# EAGLE schematic et312 (EAGLE 7.3.0)

## Sheet 1 of 6
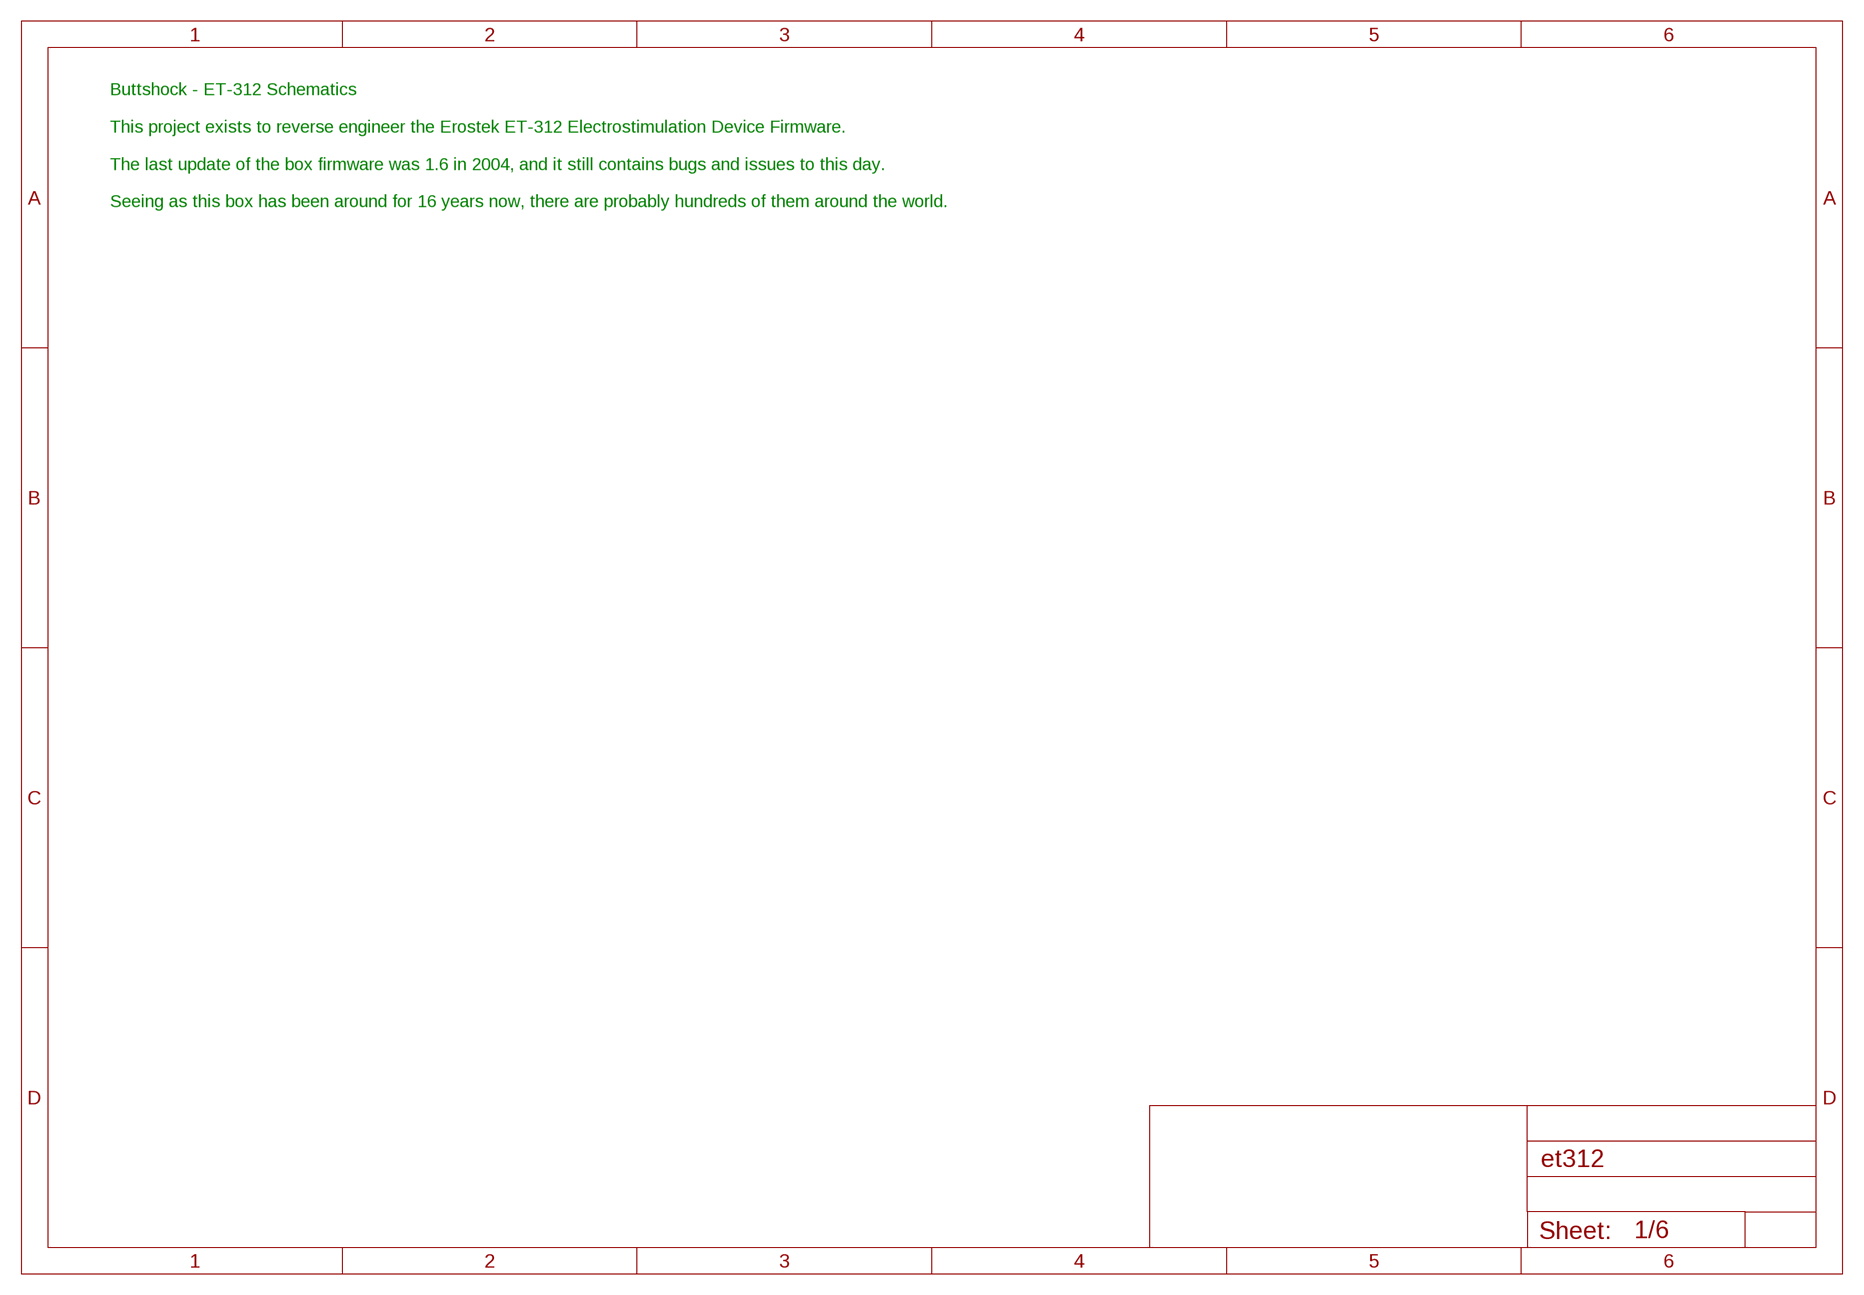
[diagram p0: schematic, sheet 1]

### Notes on the sheet
- Buttshock - ET-312 Schematics
  
  This project exists to reverse engineer the Erostek ET-312 Electrostimulation Device Firmware.
  
  The last update of the box firmware was 1.6 in 2004, and it still contains bugs and issues to this day.
  
  Seeing as this box has been around for 16 years now, there are probably hundreds of them around the world.

## Sheet 2 of 6
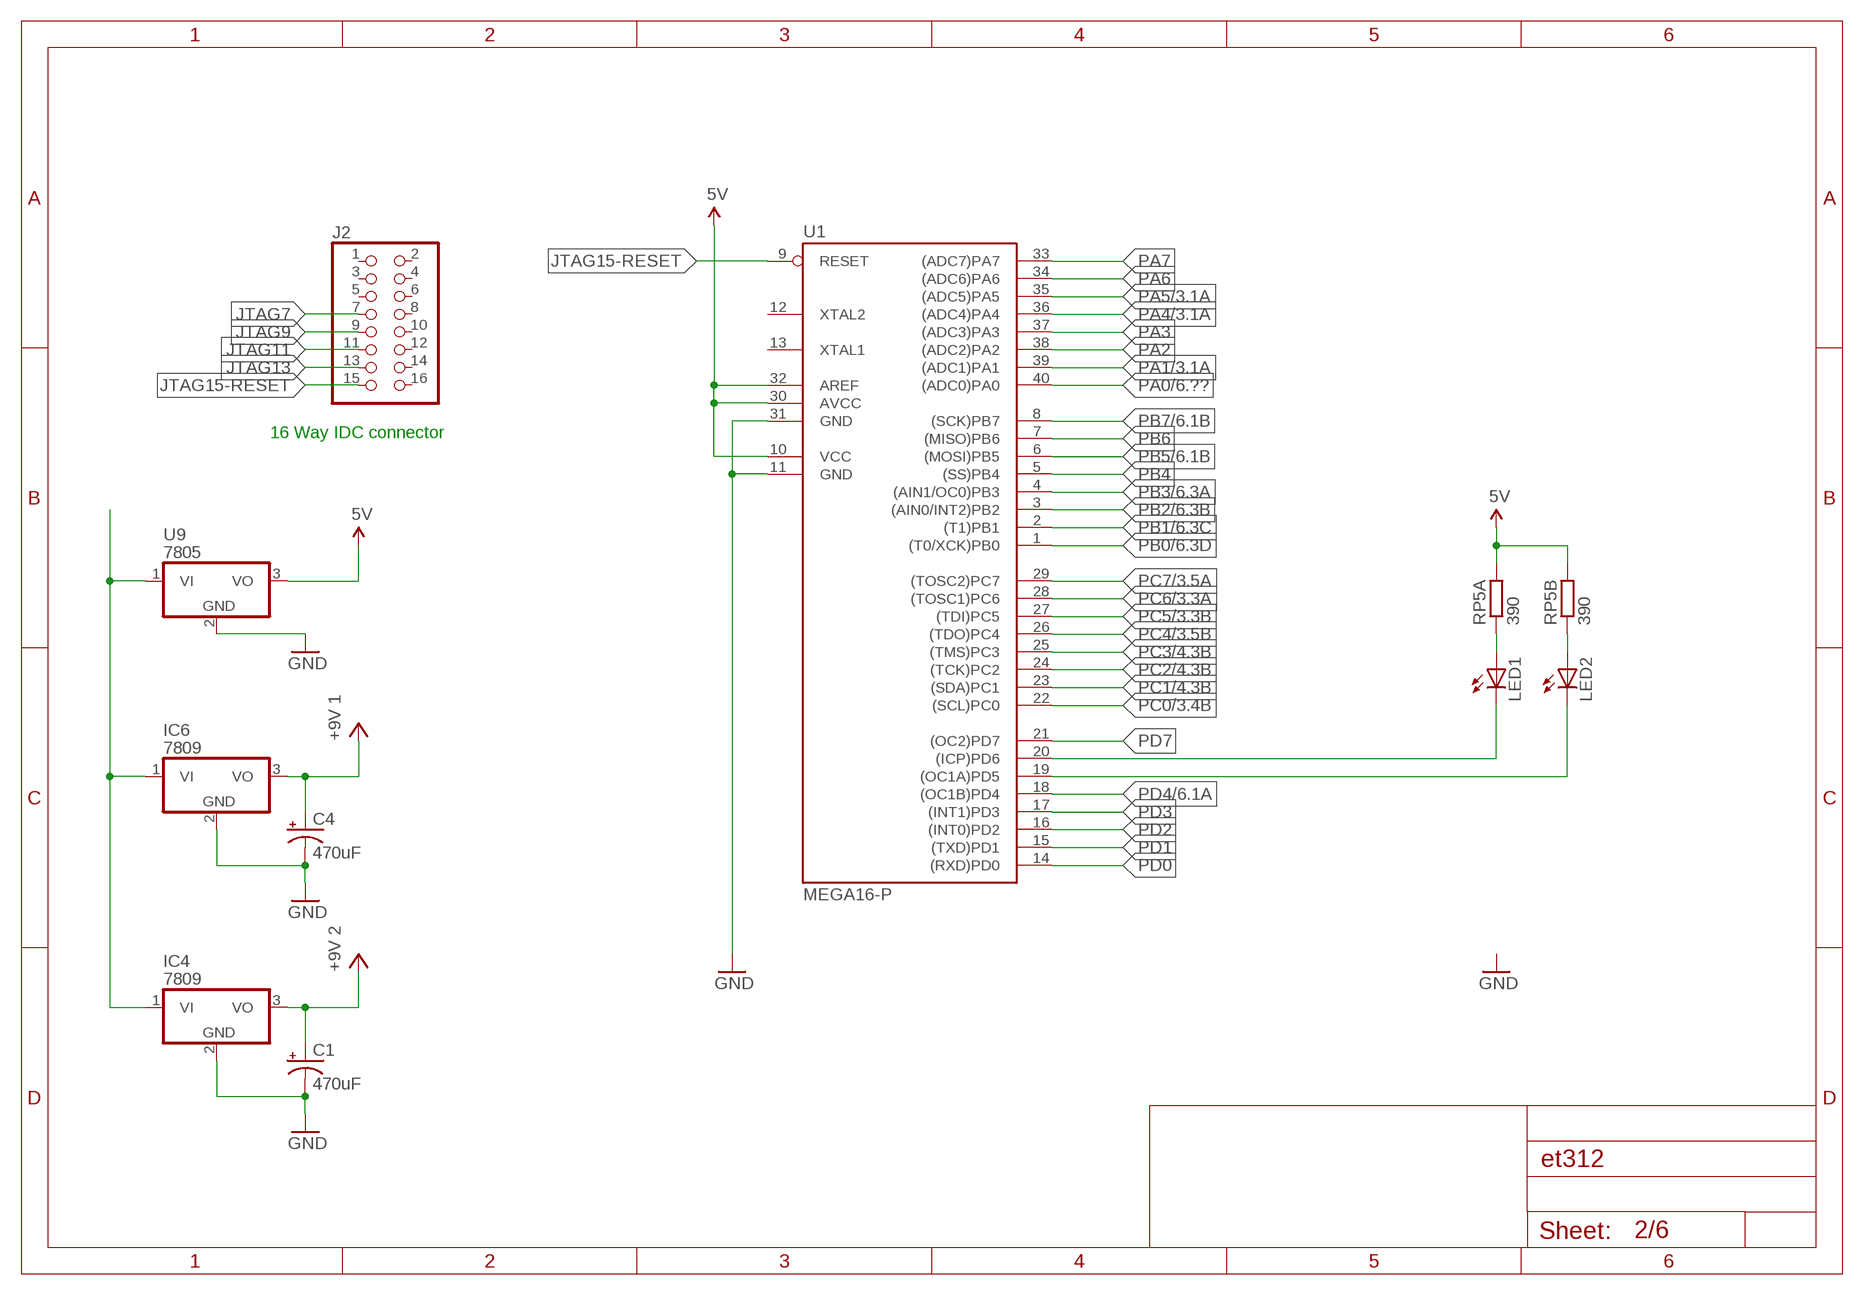
[diagram p1: schematic, sheet 2]

### Parts
C1  470uF  CAP_POLPTH1  [CPOL-RADIAL-100UF-25V]
C4  470uF  CAP_POLPTH1  [CPOL-RADIAL-100UF-25V]
IC4  7809  7805T  [TO220H]
IC6  7809  7805T  [TO220H]
J2  PINHD-2X8  [2X08]
LED1  LED3MM  [LED3MM]
LED2  LED3MM  [LED3MM]
RP5A  390  R-EU_0207/7  [0207/7]
RP5B  390  R-EU_0207/7  [0207/7]
U1  MEGA16-P  [DIL40]
U9  7805  7805T  [TO220H]

### Nets
5V: RP5A.2 RP5B.2 U1.10(VCC) U1.30(AVCC) U1.32(AREF) U9.3(VO) ; also sheet 3
GND: C1.2(-) C4.2(-) IC4.2(GND) IC6.2(GND) U1.11(GND) U1.31(GND) U9.2(GND) ; also sheet 3,6
JTAG7: J2.7
JTAG9: J2.9
JTAG11: J2.11
JTAG13: J2.13
JTAG15-RESET: J2.15 U1.9(RESET)
N$17: IC4.1(VI) IC6.1(VI) U9.1(VI)
N$23: LED2.A RP5B.1
N$29: LED1.A RP5A.1
PA0: U1.40((ADC0)PA0) ; also sheet 6
PA1: U1.39((ADC1)PA1) ; also sheet 3
PA2: U1.38((ADC2)PA2)
PA3: U1.37((ADC3)PA3)
PA4: U1.36((ADC4)PA4) ; also sheet 3
PA5: U1.35((ADC5)PA5) ; also sheet 3
PA6: U1.34((ADC6)PA6)
PA7: U1.33((ADC7)PA7)
PB0: U1.1((T0/XCK)PB0) ; also sheet 6
PB1: U1.2((T1)PB1) ; also sheet 6
PB2: U1.3((AIN0/INT2)PB2) ; also sheet 6
PB3: U1.4((AIN1/OC0)PB3) ; also sheet 6
PB4: U1.5((SS)PB4)
PB5: U1.6((MOSI)PB5) ; also sheet 6
PB6: U1.7((MISO)PB6)
PB7: U1.8((SCK)PB7) ; also sheet 6
PC0: U1.22((SCL)PC0) ; also sheet 3
PC1: U1.23((SDA)PC1) ; also sheet 4
PC2: U1.24((TCK)PC2) ; also sheet 4
PC3: U1.25((TMS)PC3) ; also sheet 4
PC4: U1.26((TDO)PC4) ; also sheet 3,4
PC5: U1.27((TDI)PC5) ; also sheet 3,4
PC6: U1.28((TOSC1)PC6) ; also sheet 3,4
PC7: U1.29((TOSC2)PC7) ; also sheet 3,4
PD0: U1.14((RXD)PD0)
PD1: U1.15((TXD)PD1)
PD2: U1.16((INT0)PD2)
PD3: U1.17((INT1)PD3)
PD4: U1.18((OC1B)PD4) ; also sheet 6
PD5: LED2.K(C) U1.19((OC1A)PD5)
PD6: LED1.K(C) U1.20((ICP)PD6)
PD7: U1.21((OC2)PD7)
VCC: C1.1(+) C4.1(+) IC4.3(VO) IC6.3(VO) ; supply symbol labelled +9V 1, +9V 2 ; also sheet 6
Unconnected: J2.1 J2.2 J2.3 J2.4 J2.5 J2.6 J2.8 J2.10 J2.12 J2.14 J2.16 U1.12(XTAL2) U1.13(XTAL1)

### Notes on the sheet
- 16 Way IDC connector

## Sheet 3 of 6
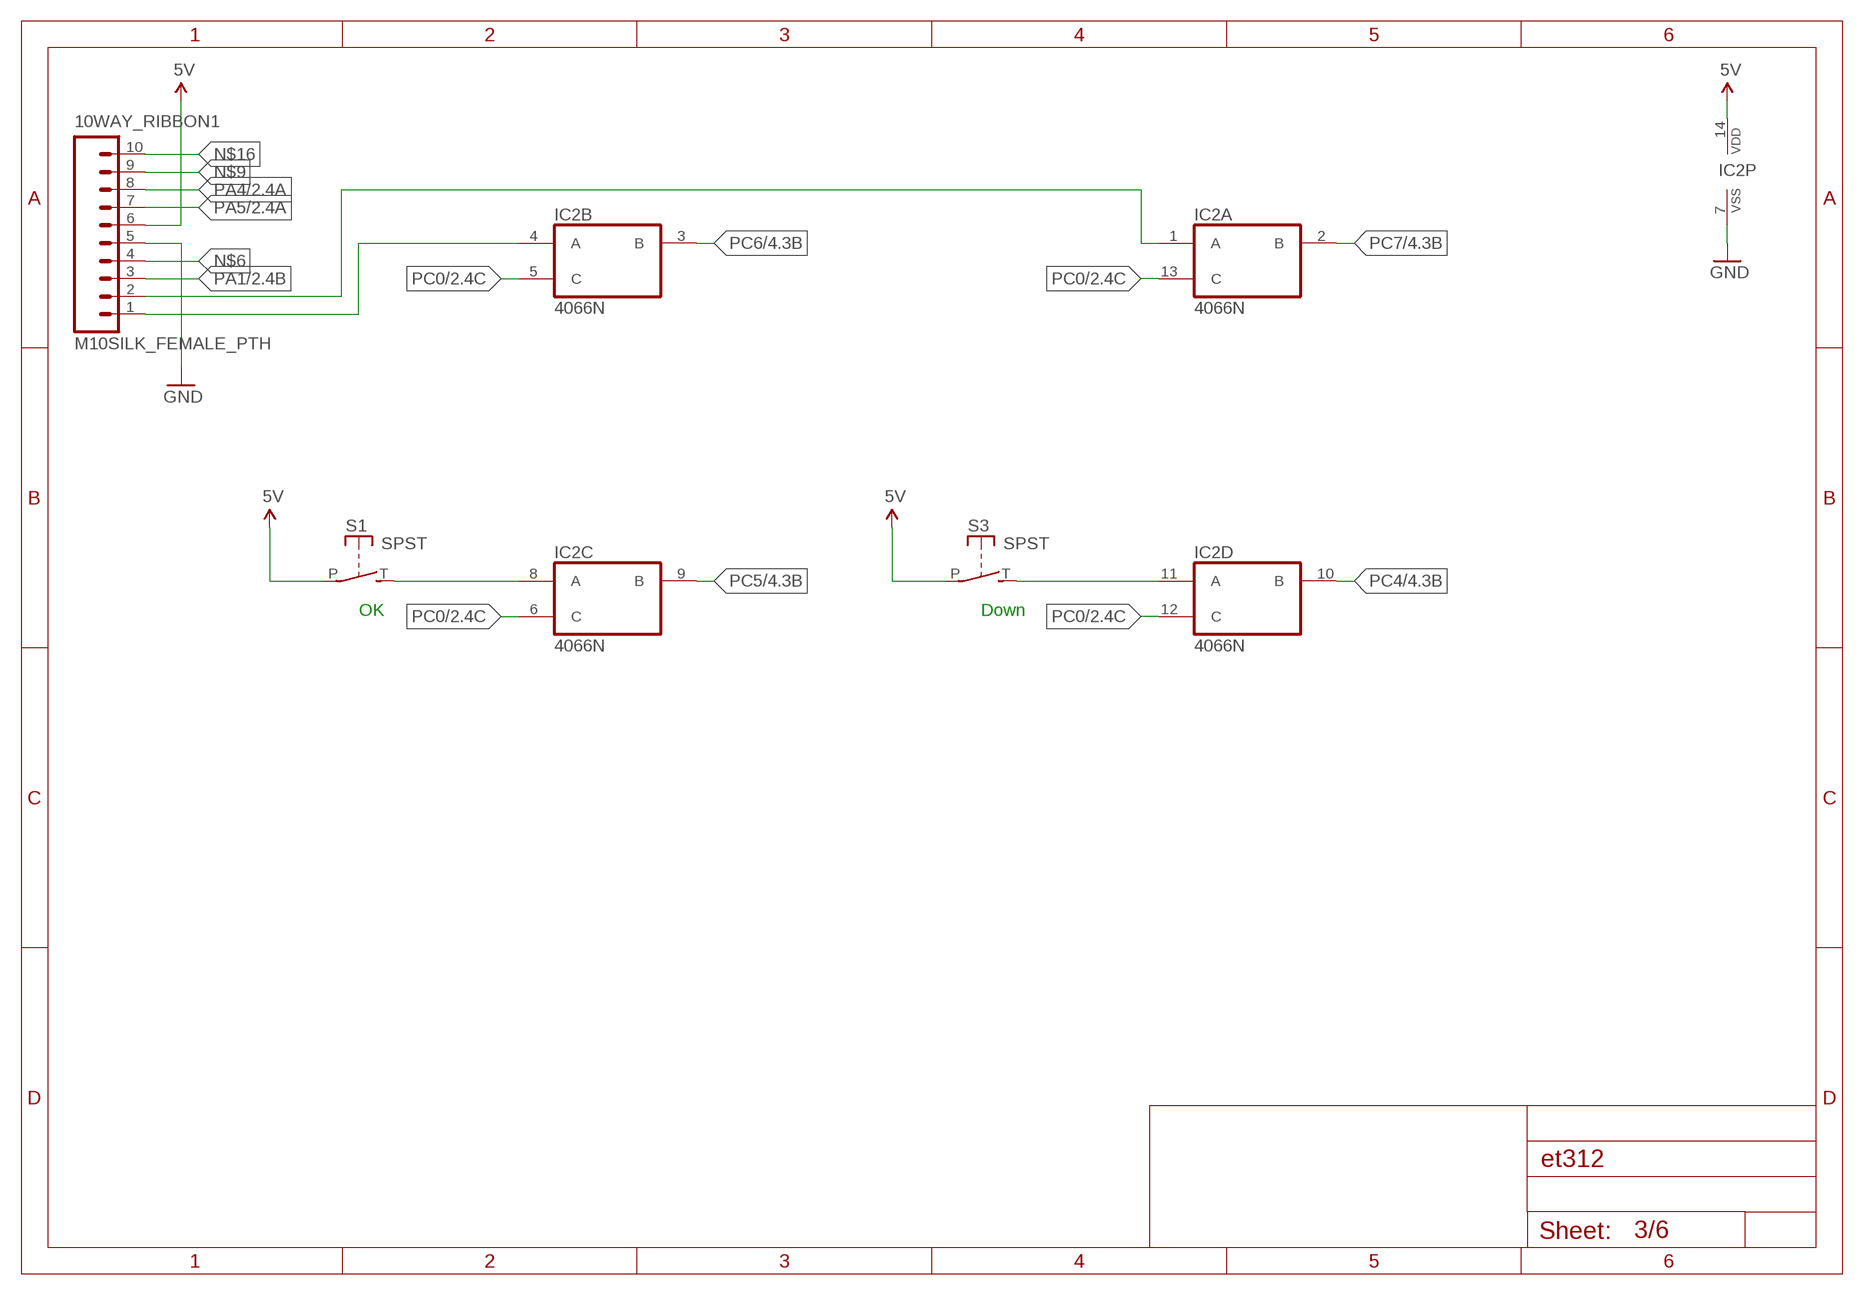
[diagram p2: schematic, sheet 3]

### Parts
10WAY_RIBBON1  M10SILK_FEMALE_PTH  [1X10]
IC2  4066N  [DIL14]
S1  SPST  [JUDCOSPST]
S3  SPST  [JUDCOSPST]

### Nets
5V: 10WAY_RIBBON1.6 IC2.14(P:VDD) S1.P S3.P ; also sheet 2
GND: 10WAY_RIBBON1.5 IC2.7(P:VSS) ; also sheet 2,6
N$4: IC2.8(C:A) S1.T(S)
N$5: IC2.11(D:A) S3.T(S)
N$6: 10WAY_RIBBON1.4
N$7: 10WAY_RIBBON1.1 IC2.4(B:A)
N$8: 10WAY_RIBBON1.2 IC2.1(A:A)
N$9: 10WAY_RIBBON1.9
N$16: 10WAY_RIBBON1.10
PA1: 10WAY_RIBBON1.3 ; also sheet 2
PA4: 10WAY_RIBBON1.8 ; also sheet 2
PA5: 10WAY_RIBBON1.7 ; also sheet 2
PC0: IC2.5(B:C) IC2.6(C:C) IC2.12(D:C) IC2.13(A:C) ; also sheet 2
PC4: IC2.10(D:B) ; also sheet 2,4
PC5: IC2.9(C:B) ; also sheet 2,4
PC6: IC2.3(B:B) ; also sheet 2,4
PC7: IC2.2(A:B) ; also sheet 2,4

### Notes on the sheet
- OK | Down

## Sheet 4 of 6
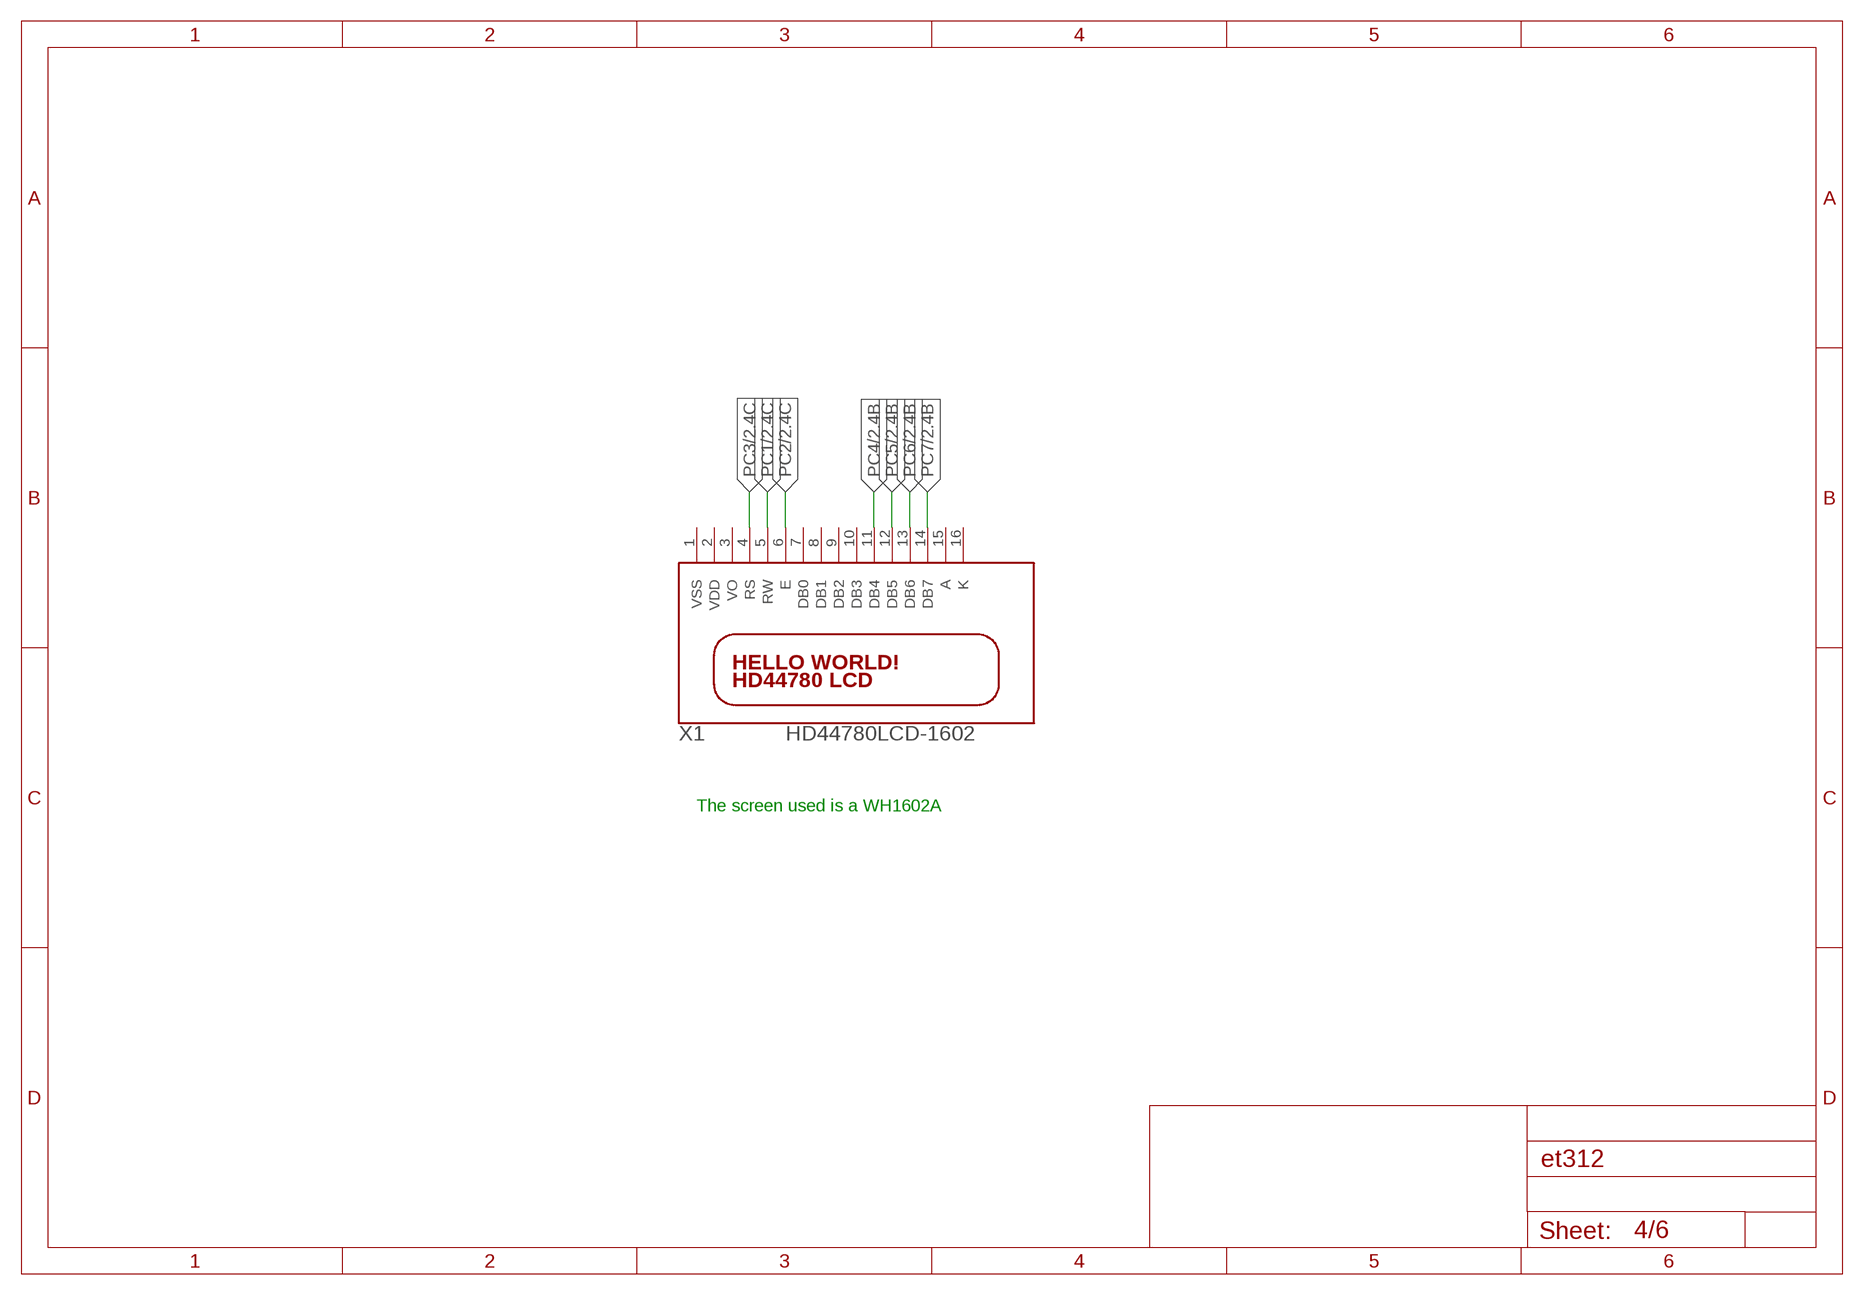
[diagram p3: schematic, sheet 4]

### Parts
X1  HD44780LCD-1602  [LCD1602]

### Nets
PC1: X1.5(RW) ; also sheet 2
PC2: X1.6(E) ; also sheet 2
PC3: X1.4(RS) ; also sheet 2
PC4: X1.11(DB4) ; also sheet 2,3
PC5: X1.12(DB5) ; also sheet 2,3
PC6: X1.13(DB6) ; also sheet 2,3
PC7: X1.14(DB7) ; also sheet 2,3
Unconnected: X1.1(VSS) X1.2(VDD) X1.3(VO) X1.7(DB0) X1.8(DB1) X1.9(DB2) X1.10(DB3) X1.15(A) X1.16(K)

### Notes on the sheet
- The screen used is a WH1602A

## Sheet 5 of 6
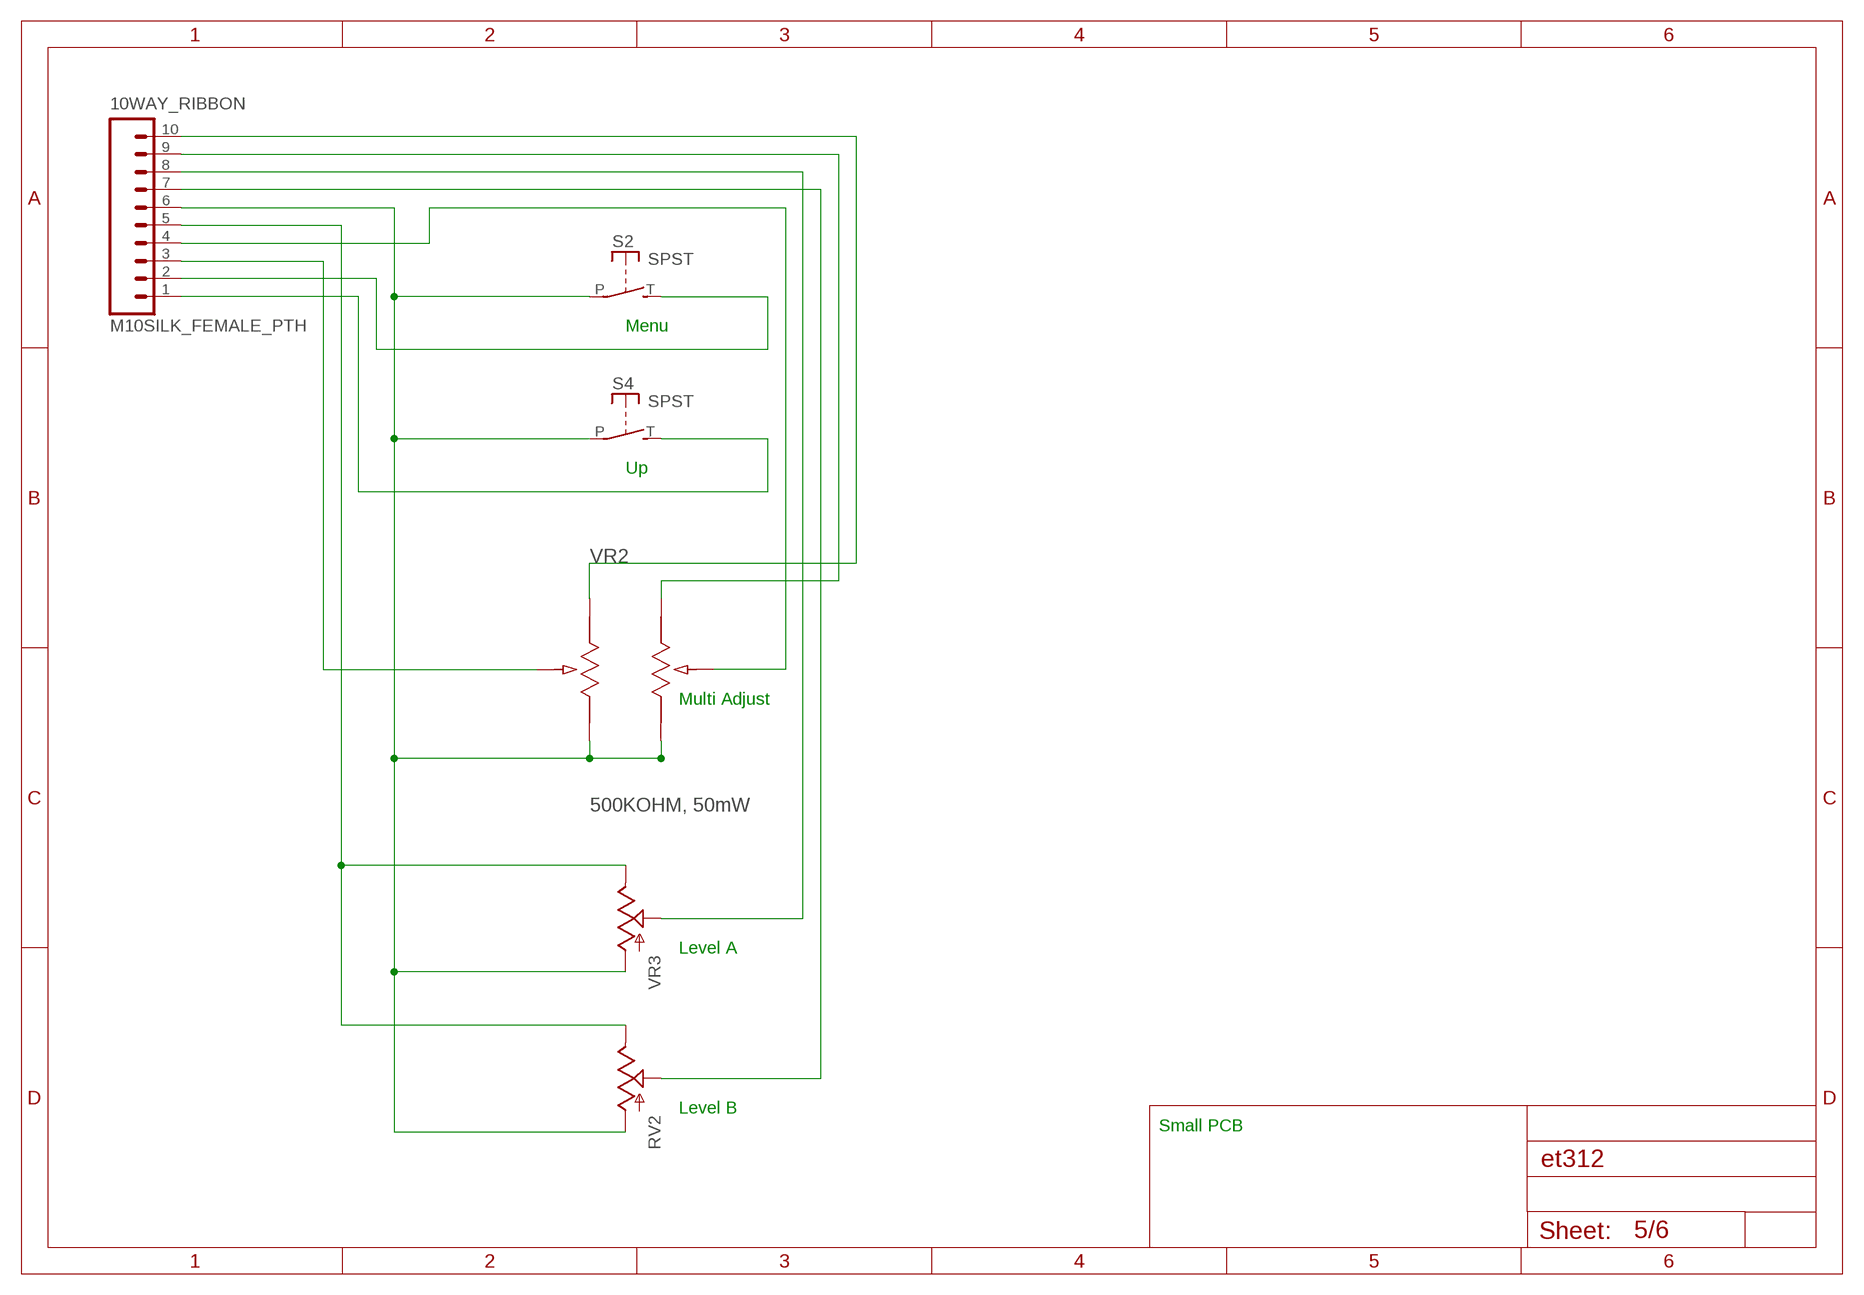
[diagram p4: schematic, sheet 5]

### Parts
10WAY_RIBBON  M10SILK_FEMALE_PTH  [1X10]
RV2  POT  [ALPS_POT]
S2  SPST  [JUDCOSPST]
S4  SPST  [JUDCOSPST]
VR2  500KOHM, 50mW  EVJC20F02A14-JC2  [POT_EVJC20]
VR3  POT  [ALPS_POT]

### Nets
N$1: 10WAY_RIBBON.6 RV2.P$3(A) S2.P S4.P VR2.1 VR2.1' VR3.P$3(A)
N$2: 10WAY_RIBBON.2 S2.T(S)
N$3: 10WAY_RIBBON.1 S4.T(S)
N$10: 10WAY_RIBBON.9 VR2.3'
N$11: 10WAY_RIBBON.8 VR3.P$2(S)
N$12: 10WAY_RIBBON.7 RV2.P$2(S)
N$13: 10WAY_RIBBON.10 VR2.3
N$14: 10WAY_RIBBON.4 VR2.2'
N$15: 10WAY_RIBBON.3 VR2.2
VR4: 10WAY_RIBBON.5 RV2.P$1(E) VR3.P$1(E)

### Notes on the sheet
- Menu
- Up
- Multi Adjust
- Level A
- Level B
- Small PCB

## Sheet 6 of 6: Output stage
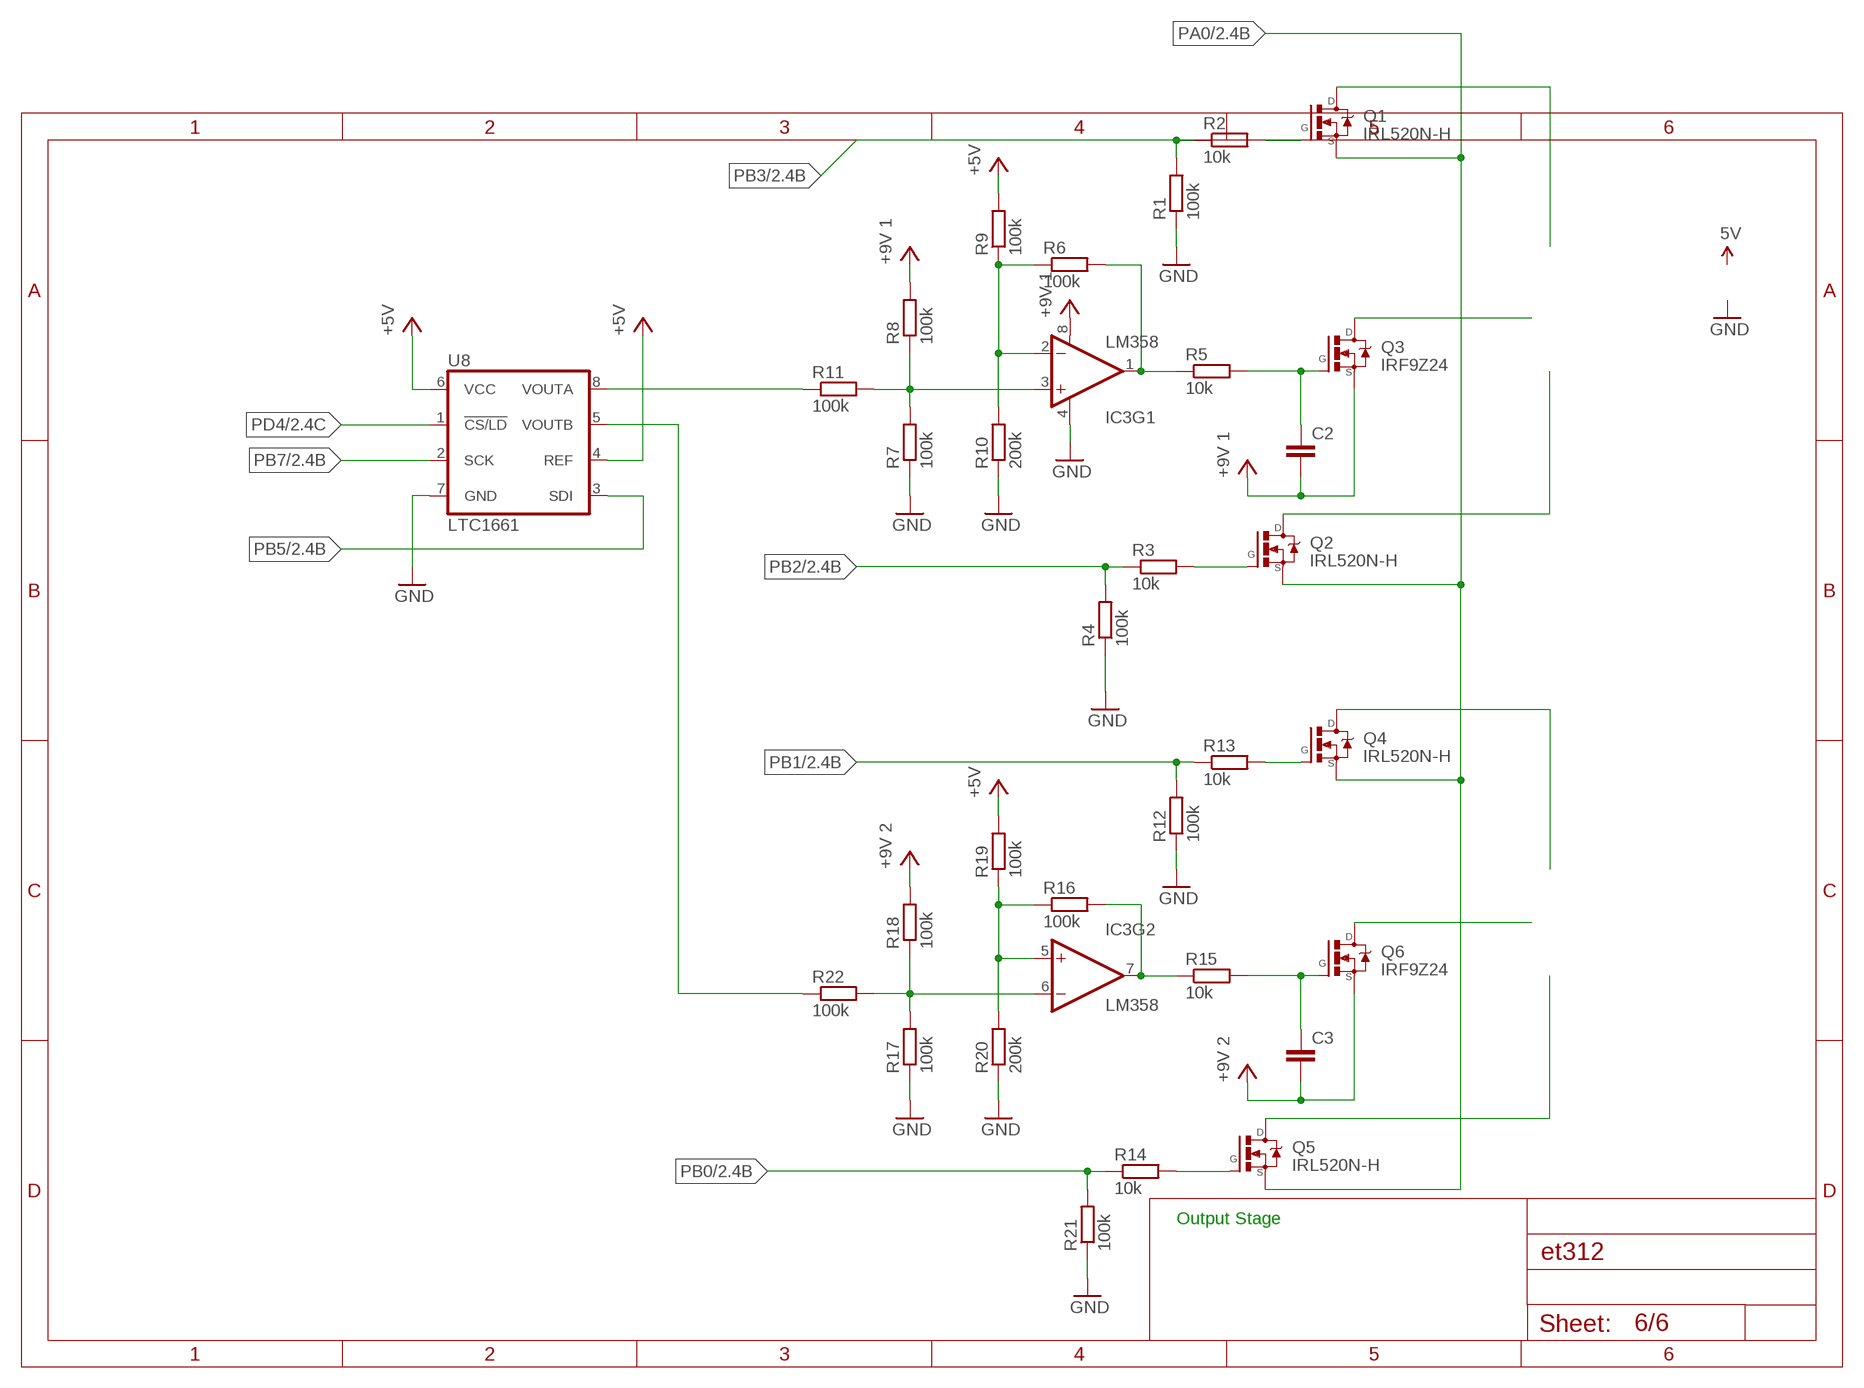
[diagram p5: schematic, sheet 6]

### Parts
C2  CAPPTH  [CAP-PTH-SMALL]
C3  CAPPTH  [CAP-PTH-SMALL]
IC3  LM358  [DIP08]
Q1  IRL520N-H  IRL530N-H  [TO220]
Q2  IRL520N-H  IRL530N-H  [TO220]
Q3  IRF9Z24  IRL530N-H  [TO220]
Q4  IRL520N-H  IRL530N-H  [TO220]
Q5  IRL520N-H  IRL530N-H  [TO220]
Q6  IRF9Z24  IRL530N-H  [TO220]
R1  100k  R0207/10  [0207/10]
R2  10k  R0207/10  [0207/10]
R3  10k  R0207/10  [0207/10]
R4  100k  R0207/10  [0207/10]
R5  10k  R0207/10  [0207/10]
R6  100k  R0207/10  [0207/10]
R7  100k  R0207/10  [0207/10]
R8  100k  R0207/10  [0207/10]
R9  100k  R0207/10  [0207/10]
R10  200k  R0207/10  [0207/10]
R11  100k  R0207/10  [0207/10]
R12  100k  R0207/10  [0207/10]
R13  10k  R0207/10  [0207/10]
R14  10k  R0207/10  [0207/10]
R15  10k  R0207/10  [0207/10]
R16  100k  R0207/10  [0207/10]
R17  100k  R0207/10  [0207/10]
R18  100k  R0207/10  [0207/10]
R19  100k  R0207/10  [0207/10]
R20  200k  R0207/10  [0207/10]
R21  100k  R0207/10  [0207/10]
R22  100k  R0207/10  [0207/10]
U8  LTC1661  LTC2602CMS8  [MSOP8]

### Nets
GND: IC3.4(V-) R1.1 R4.1 R7.1 R10.1 R12.1 R17.1 R20.1 R21.1 U8.7(GND) ; also sheet 2,3
N$18: Q1.1(G) R2.2
N$19: Q2.1(G) R3.2
N$20: IC3.1(OUT) R5.1 R6.2
N$21: C2.1 Q3.1(G) R5.2
N$22: IC3.3(+IN) R7.2 R8.1 R11.2
N$24: Q4.1(G) R13.2
N$25: Q5.1(G) R14.2
N$26: IC3.7(OUT) R15.1 R16.2
N$27: C3.1 Q6.1(G) R15.2
N$28: IC3.6(-IN) R17.2 R18.1 R22.2
N$33: R22.1 U8.5(VOUTB)
N$34: Q1.2(D)
N$35: Q3.2(D)
N$36: Q4.2(D)
N$37: Q6.2(D)
N$38: Q5.2(D)
N$39: Q2.2(D)
N$40: IC3.2(-IN) R6.1 R9.1 R10.2
N$41: IC3.5(+IN) R16.1 R19.1 R20.2
N$42: R11.1 U8.8(VOUTA)
PA0: Q1.3(S) Q2.3(S) Q4.3(S) Q5.3(S) ; also sheet 2
PB0: R14.1 R21.2 ; also sheet 2
PB1: R12.2 R13.1 ; also sheet 2
PB2: R3.1 R4.2 ; also sheet 2
PB3: R1.2 R2.1 ; also sheet 2
PB5: U8.3(SDI) ; also sheet 2
PB7: U8.2(SCK) ; also sheet 2
PD4: U8.1(!CS/LD) ; also sheet 2
VCC: C2.2 C3.2 IC3.8(V+) Q3.3(S) Q6.3(S) R8.2 R9.2 R18.2 R19.2 U8.4(REF) U8.6(VCC) ; supply symbol labelled +5V, +9V 1, +9V 2 ; also sheet 2

### Notes on the sheet
- Output Stage

## Library data of the parts
10WAY_RIBBON 10WAY_RIBBON1 = SparkFun-Connectors:M10: Header 10 Standard 10-pin 0.1" header. Use with straight break away headers (SKU : PRT-00116), right angle break away headers (PRT-00553), swiss pins (PRT-00743), machine pins (PRT-00117), and female headers (PRT-00115).; PROD_ID: CONN-11563
C1 C4 = SparkFun-Passives:CAP_POL: Capacitor Polarized These are standard SMD and PTH capacitors. Normally 10uF, 47uF, and 100uF in electrolytic and tantalum varieties. Always verify the external diameter of the through hole cap, it varies with capacity, voltage, and manufacturer. The EIA devices should be standard.
C2 C3 = SparkFun-Passives:CAP: Capacitor Standard 0603 ceramic capacitor, and 0.1" leaded capacitor.
IC2 = 40xx:4066: Quad bilateral ANALOG SWITCH
IC3 = SparkFun-AnalogIC:LM358: Jellybean op-amp; PROD_ID: IC-09172
IC4 IC6 U9 = adafruit:78*: Positive VOLTAGE REGULATOR Added bigger pads to the TO-92 package
J2 = pinhead:PINHD-2X8: PIN HEADER
LED1 LED2 = adafruit:LED: LED OSRAM: - CHIPLED LG R971, LG N971, LY N971, LG Q971, LY Q971, LO R971, LY R971 LH N974, LH R974 LS Q976, LO Q976, LY Q976 LO Q996 - Hyper CHIPLED LW Q18S LB Q993, LB Q99A, LB R99A - SideLED LS A670, LO A670, LY A670, LG A670, LP A670 LB A673, LV A673, LT A673, LW A673 LH A674 LY A675 LS A676, LA A676, LO A676, LY A676, LW A676 LS A679, LY A679, LG A679 - Hyper Micro SIDELED® LS Y876, LA Y876, LO Y876, LY Y876 LT Y87S - SmartLED LW L88C, LW L88S LB L89C, LB L89S, LG L890 LS L89K, LO L89K, LY L89K LS L896, LA L896, LO L896, LY L896 - TOPLED LS T670, LO T670, LY T670, LG T670, LP T670 LSG T670, LSP T670, LSY T670, LOP T670, LYG T670 LG T671, LOG T671, LSG T671 LB T673, LV T673, LT T673, LW T673 LH T674 LS T676, LA T676, LO T676, LY T676, LB T676, LH T676, LSB T676, LW T676 LB T67C, LV T67C, LT T67C, LS T67K, LO T67K, LY T67K, LW E67C LS E67B, LA E67B, LO E67B, LY E67B, LB E67C, LV E67C, LT E67C LW T67C LS T679, LY T679, LG T679 LS T770, LO T770, LY T770, LG T770, LP T770 LB T773, LV T773, LT T773, LW T773 LH T774 LS E675, LA E675, LY E675, LS T675 LS T776, LA T776, LO T776, LY T776, LB T776 LHGB T686 LT T68C, LB T68C - Hyper Mini TOPLED® LB M676 - Mini TOPLED Santana® LG M470 LS M47K, LO M47K, LY M47K Source: http://www.osram.convergy.de/
Q1-Q6 = transistor-fet-1:IRL530: MOSFET 17A 22.7nC 100mOhm Logic Level
R1-R22 = eagle-ltspice:R: RESISTOR, European symbol; SPICEMODEL: NONE; SPICEPREFIX: R
RP5A RP5B = rcl:R-EU_: RESISTOR, European symbol
RV2 VR3 = SparkFun-Electromechanical:POT
S1-S4 = adafruit:SPST: Judco 50-0015-00
U1 = atmel:MEGA16-P: MICROCONTROLLER 16 Kbytes FLASH 1 kbytes SRAM 512 bytes EEPROM USART 8-channel 10 bit ADC Source: avr.lbr; MPN: ATMEGA16-16PU; OC_FARNELL: 9171142; OC_NEWARK: 01M6885
U8 = linear-technology:LTC26*: Dual 16-/14-/12-Bit Rail-to-Rail DACs Source: www.linear.com; MPN: LTC2602CMS8; OC_FARNELL: 1330944; OC_NEWARK: 56M5818
VR2 = Panasonic-Trimmer_Potentiometers:EVJ: 12 mm Square Two-in-One Rotary Potentiometers (Dual Type); MPN: EVJC20F02A14; OC_FARNELL: 2284569; OC_NEWARK: 52W2256; PACKAGE: TH-POT; SUPPLIER: PANASONIC
X1 = adafruit:HD44780LCD: HD44780 LCD Standard character type LCDs, available in sizes from 8x1 to 40x4!

## Net classes
0 default: width 0.4 mm
1 signal: width 0.254 mm
2 pwr: width 2 mm